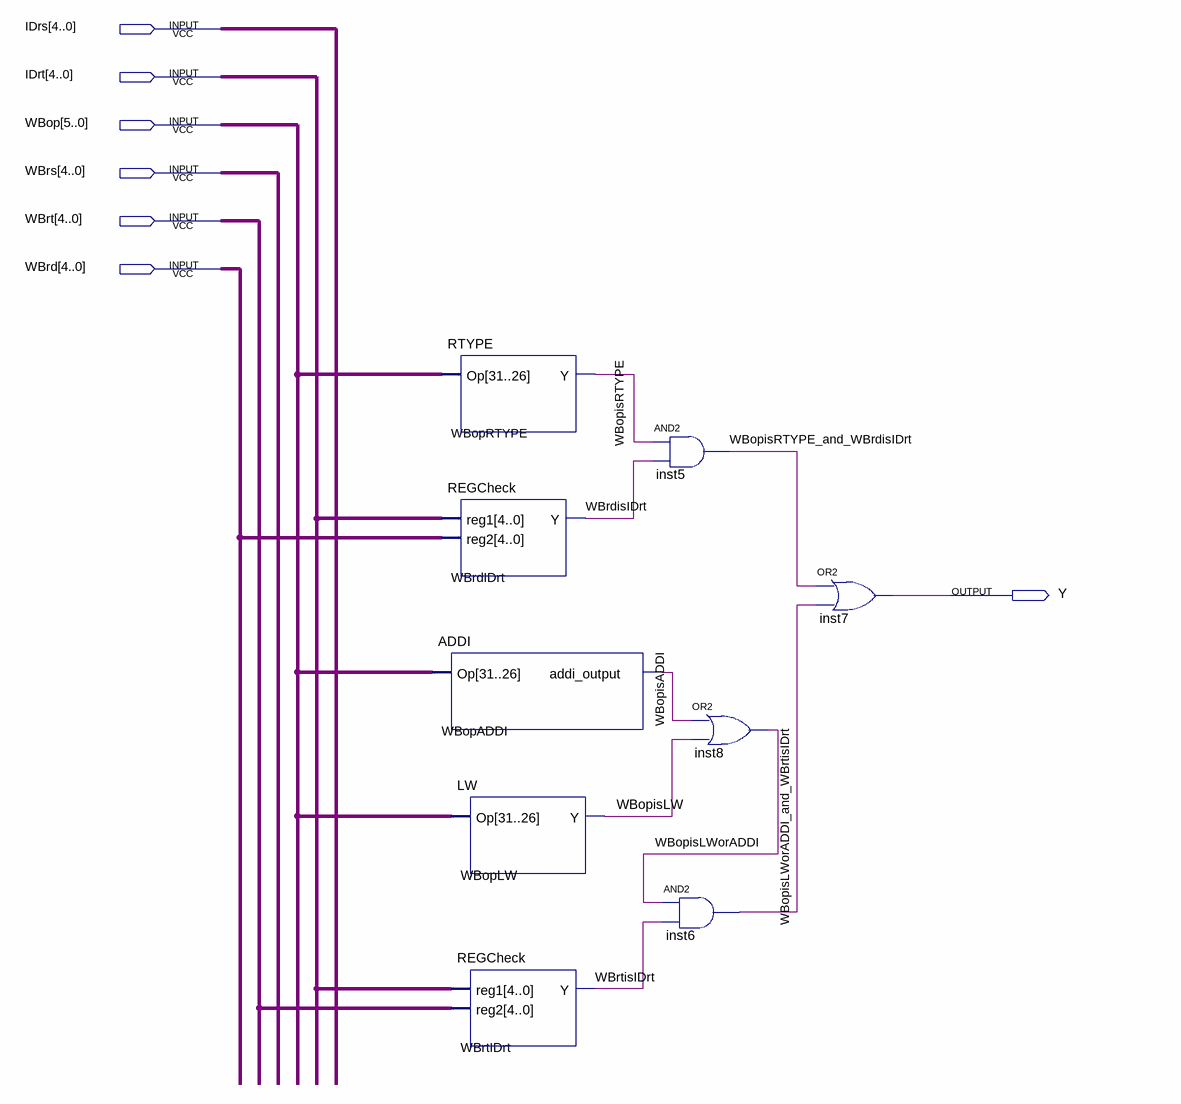
[diagram p0: schematic sheet]
// Quartus schematic ForwardBfromWBtoID.bdf as structural Verilog: 9 symbols, 7 pins
module ForwardBfromWBtoID (
  input  [4:0] IDrs,
  input  [4:0] IDrt,
  input  [5:0] WBop,
  input  [4:0] WBrs,
  input  [4:0] WBrt,
  input  [4:0] WBrd,
  output Y
);

  wire WBopisADDI, WBopisLW, WBopisLWorADDI, WBopisLWorADDI_and_WBrtisIDrt, WBopisRTYPE,
       WBopisRTYPE_and_WBrdisIDrt, WBrdisIDrt, WBrtisIDrt;

  RTYPE WBopRTYPE (.Op(WBop), .Y(WBopisRTYPE));
  REGCheck WBrdIDrt (.reg1(IDrt), .reg2(WBrd), .Y(WBrdisIDrt));
  ADDI WBopADDI (.Op(WBop), .addi_output(WBopisADDI));
  LW WBopLW (.Op(WBop), .Y(WBopisLW));
  REGCheck WBrtIDrt (.reg1(IDrt), .reg2(WBrt), .Y(WBrtisIDrt));
  and inst5 (WBopisRTYPE_and_WBrdisIDrt, WBopisRTYPE, WBrdisIDrt);
  and inst6 (WBopisLWorADDI_and_WBrtisIDrt, WBopisLWorADDI, WBrtisIDrt);
  or inst8 (WBopisLWorADDI, WBopisADDI, WBopisLW);
  or inst7 (Y, WBopisRTYPE_and_WBrdisIDrt, WBopisLWorADDI_and_WBrtisIDrt);
endmodule
